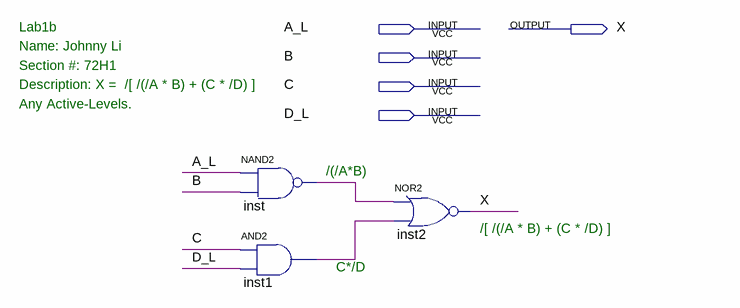
[diagram p0: schematic sheet]
// Quartus schematic lab1b.bdf as structural Verilog: 3 symbols, 5 pins
module lab1b (
  input  A_L,
  input  B,
  input  C,
  input  D_L,
  output X
);

  wire inst1_out, inst_out;

  nand inst (inst_out, A_L, B);
  and inst1 (inst1_out, C, D_L);
  nor inst2 (X, inst_out, inst1_out);

  // Notes on the sheet:
  //   Lab1b
  //   Name: Johnny Li
  //   Section #: 72H1
  //   Description: X =  /[ /(/A * B) + (C * /D) ]
  //   Any Active-Levels.
  //   /(/A*B)
  //   /[ /(/A * B) + (C * /D) ]
  //   C*/D
endmodule
